# Altium schematic sheet Power.SchDoc
size A4
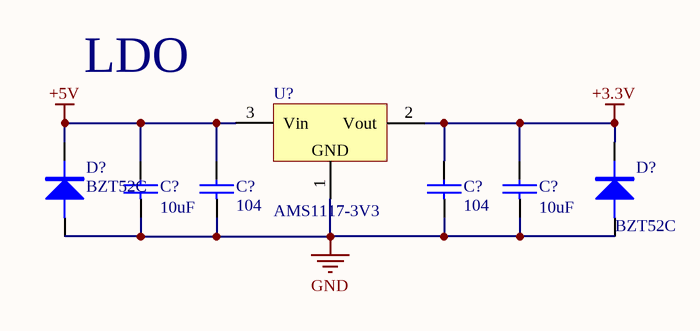
[diagram p0: Power.SchDoc]

## Parts
(Parts that share a designator on the sheet are numbered #1, #2 ... from top to bottom, then left to right.)
C?#1  10uF  [0603C]
C?#2  104  [0603C]
C?#3  104  [0603C]
C?#4  10uF  [0603C]
D?#1  BZT52C  [SOD-123]
D?#2  BZT52C  [SOD-123]
U?  AMS1117-3V3  [SOT89]

## Nets
+3.3V: C?#3.2 C?#4.2 D?#2.K U?.2(Vout)
+5V: C?#1.2 C?#2.2 D?#1.K U?.3(Vin)
GND: C?#1.1 C?#2.1 C?#3.1 C?#4.1 D?#1.A D?#2.A U?.1(GND)

## Notes on the sheet
- LDO

## Library data of the parts
C?#1-C?#4 = CAP: 无极性电容
D?#1 D?#2 = DIODE: 普通二极管
U? = AMS1117: 三端稳压芯片; BOM名称: 稳压芯片; 版权归属: 源创客; 学习资源: www.ooocke.com